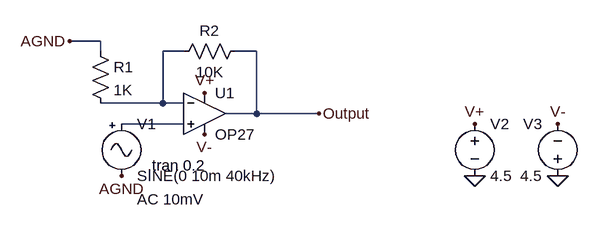
[diagram p0: schematic AmpCircuit.asc]
AmpCircuit.asc, the LTspice schematic file:
Version 4
SHEET 1 880 680
WIRE 96 32 48 32
WIRE 96 48 96 32
WIRE 224 48 192 48
WIRE 336 48 304 48
WIRE 192 128 192 48
WIRE 192 128 96 128
WIRE 224 128 192 128
WIRE 336 144 336 48
WIRE 336 144 288 144
WIRE 432 144 336 144
WIRE 224 160 128 160
FLAG 256 112 V+
FLAG 256 176 V-
FLAG 432 144 Output
FLAG 672 240 0
FLAG 800 240 0
FLAG 672 160 V+
FLAG 800 160 V-
FLAG 128 240 AGND
FLAG 48 32 AGND
SYMBOL res 80 32 R0
SYMATTR InstName R1
SYMATTR Value 1K
SYMATTR SpiceLine tol=1 pwr=0.1
SYMBOL res 320 32 R90
WINDOW 0 0 56 VBottom 2
WINDOW 3 32 56 VTop 2
SYMATTR InstName R2
SYMATTR Value 10K
SYMATTR SpiceLine tol=1 pwr=0.1
SYMBOL Opamps\\OP27 256 80 R0
SYMATTR InstName U1
SYMBOL Misc\\signal 128 144 R0
WINDOW 123 24 132 Left 2
WINDOW 39 0 0 Left 0
SYMATTR InstName V1
SYMATTR Value SINE(0 10m 40kHz)
SYMATTR Value2 AC 10mV
SYMBOL voltage 672 144 R0
WINDOW 123 0 0 Left 0
WINDOW 39 0 0 Left 0
SYMATTR InstName V2
SYMATTR Value 4.5
SYMBOL voltage 800 256 R180
WINDOW 0 24 96 Left 2
WINDOW 3 24 16 Left 2
WINDOW 123 0 0 Left 0
WINDOW 39 0 0 Left 0
SYMATTR InstName V3
SYMATTR Value 4.5
TEXT 168 224 Left 2 !.tran 0.2

The netlist it stands for:
* AmpCircuit.asc
R1 AGND N001 1K tol=1 pwr=0.1
R2 Output N001 10K tol=1 pwr=0.1
XU1 N002 N001 V+ V- Output OP27  ; pins In+ In- V+ V- OUT
V1 N002 AGND SINE(0 10m 40kHz) AC 10mV
V2 V+ 0 4.5
V3 0 V- 4.5
.tran 0.2
.lib ADI.lib
.backanno
.end